# EAGLE schematic SteeringWheel (EAGLE 8.2.2)
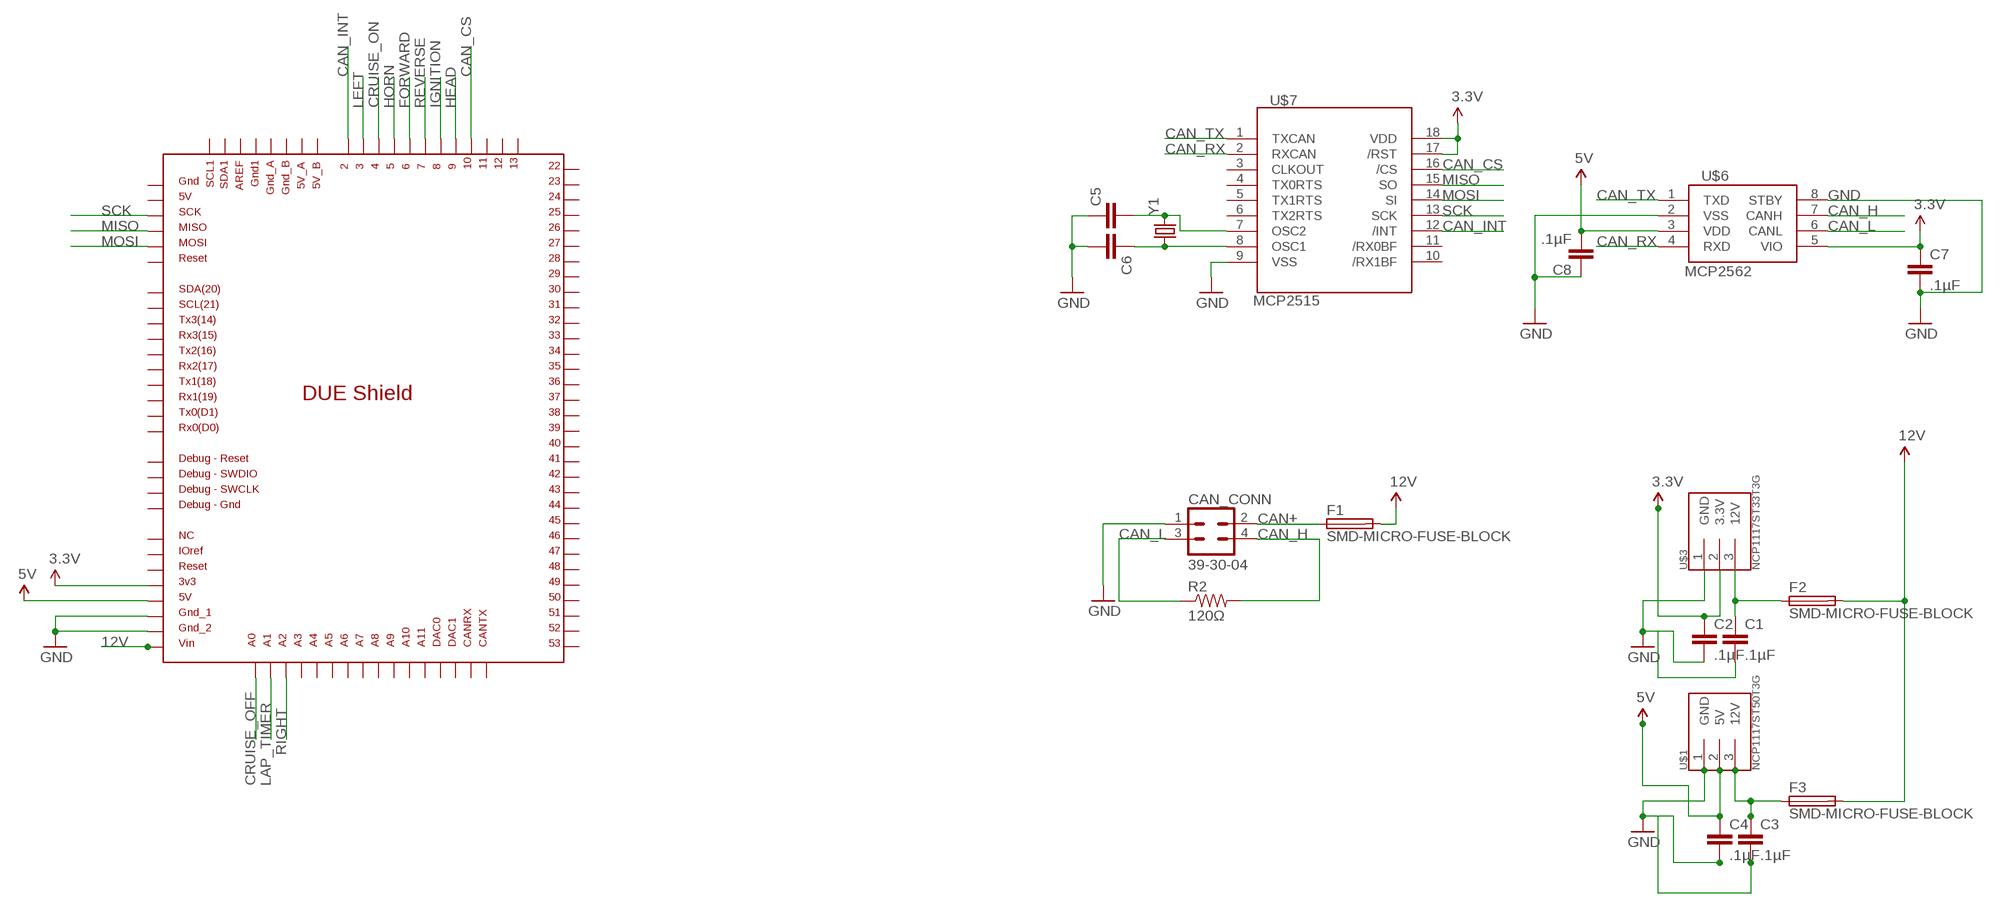
[diagram p0: schematic, sheet 1]

## Parts
C1  .1µF  CAP0805  [0805]
C2  .1µF  CAP0805  [0805]
C3  .1µF  CAP0805  [0805]
C4  .1µF  CAP0805  [0805]
C5  CAP0805  [0805]
C6  CAP0805  [0805]
C7  .1µF  CAP0805  [0805]
C8  .1µF  CAP0805  [0805]
CAN_CONN  39-30-04  [39-30-?04?]
F1  SMD-MICRO-FUSE-BLOCK  [OMNIBLOK]
F2  SMD-MICRO-FUSE-BLOCK  [OMNIBLOK]
F3  SMD-MICRO-FUSE-BLOCK  [OMNIBLOK]
R2  120Ω  RESISTOR0805-RES  [0805]
U$1  NCP1117ST50T3G  [SOT223]
U$2  DUE(NORMAL)  [DUE(NORMAL)]
U$3  NCP1117ST33T3G  [SOT223]
U$6  MCP2562  [SOIC8]
U$7  MCP2515  [SO-18W]
Y1  CRYSTALHC49US  [HC49US]

## Nets
3.3V: C2.1 C7.1 U$2.3V3 U$3.2(3.3V) U$6.5(VIO) U$7.17(/RST) U$7.18(VDD)
5V: C4.1 C8.2 U$1.2(5V) U$2.5V U$6.3(VDD)
12V: F1.P$2 F2.P$2 F3.P$2 U$2.VIN
CAN+: CAN_CONN.2 F1.P$1
CAN_CS: U$2.10 U$7.16(/CS)
CAN_H: CAN_CONN.4 R2.2 U$6.7(CANH)
CAN_INT: U$2.2 U$7.12(/INT)
CAN_L: CAN_CONN.3 R2.1 U$6.6(CANL)
CAN_RX: U$6.4(RXD) U$7.2(RXCAN)
CAN_TX: U$6.1(TXD) U$7.1(TXCAN)
CRUISE_OFF: U$2.A0
CRUISE_ON: U$2.4
FORWARD: U$2.6
GND: C1.2 C2.2 C3.2 C4.2 C5.1 C6.2 C7.2 C8.1 CAN_CONN.1 U$1.1(GND) U$2.GND_1 U$2.GND_2 U$3.1(GND) U$6.2(VSS) U$6.8(STBY) U$7.9(VSS)
HEAD: U$2.9
HORN: U$2.5
IGNITION: U$2.8
LAP_TIMER: U$2.A1
LEFT: U$2.3
MISO: U$2.MISO_ICSP U$7.15(SO)
MOSI: U$2.MOSI_ICSP U$7.14(SI)
N$1: C3.1 F3.P$1 U$1.3(12V)
N$2: C1.1 F2.P$1 U$3.3(12V)
N$7: C5.2 U$7.7(OSC2) Y1.2
N$11: C6.1 U$7.8(OSC1) Y1.1
REVERSE: U$2.7
RIGHT: U$2.A2
SCK: U$2.SCK_ICSP U$7.13(SCK)
Unconnected: U$2.5V_A U$2.5V_B U$2.5V_ICSP U$2.11 U$2.12 U$2.13 U$2.22 U$2.23 U$2.24 U$2.25 U$2.26 U$2.27 U$2.28 U$2.29 U$2.30 U$2.31 U$2.32 U$2.33 U$2.34 U$2.35 U$2.36 U$2.37 U$2.38 U$2.39 U$2.40 U$2.41 U$2.42 U$2.43 U$2.44 U$2.45 U$2.46 U$2.47 U$2.48 U$2.49 U$2.50 U$2.51 U$2.52 U$2.53 U$2.A3 U$2.A4 U$2.A5 U$2.A6 U$2.A7 U$2.A8 U$2.A9 U$2.A10 U$2.A11 U$2.AREF U$2.CANRX U$2.CANTX U$2.DAC0 U$2.DAC1 U$2.GND1 U$2.GND_A U$2.GND_B U$2.GND_DEBUG U$2.GND_ICSP U$2.IOREF U$2.NC U$2.RESET U$2.RESET_DEBUG U$2.RESET_ICSP U$2.RX0 U$2.RX1 U$2.RX2 U$2.RX3 U$2.SCL U$2.SCL1 U$2.SDA U$2.SDA1 U$2.SWCLK_DEBUG U$2.SWDIO_DEBUG U$2.TX0 U$2.TX1 U$2.TX2 U$2.TX3 U$7.3(CLKOUT) U$7.4(TX0RTS) U$7.5(TX1RTS) U$7.6(TX2RTS) U$7.10(/RX1BF) U$7.11(/RX0BF)

## Library data of the parts
C1-C8 = SparkFun-Capacitors:CAP: Capacitor Standard 0603 ceramic capacitor, and 0.1" leaded capacitor.
CAN_CONN = con-molex-mini-fit:39-30-?04?: HEADER
F1-F3 = f-lf-omniblok-s:SMD-MICRO-FUSE
R2 = SparkFun-Resistors:RESISTOR: Resistor Basic schematic elements and footprints for 0603, 1206, and PTH resistors.
U$1 = NUSOLAR_Custom:NCP1117ST50T3G
U$2 = DUElib130425:DUE(NORMAL)
U$3 = NUSOLAR_Custom:NCP1117ST33T3G
U$6 = NUSOLAR_Custom:MCP2562
U$7 = NUSOLAR_Custom:MCP2515
Y1 = SparkFun-FreqCtrl:CRYSTAL: Various standard crystals. Proven footprints.